# EAGLE design sensor_board (EAGLE 9.7.0)
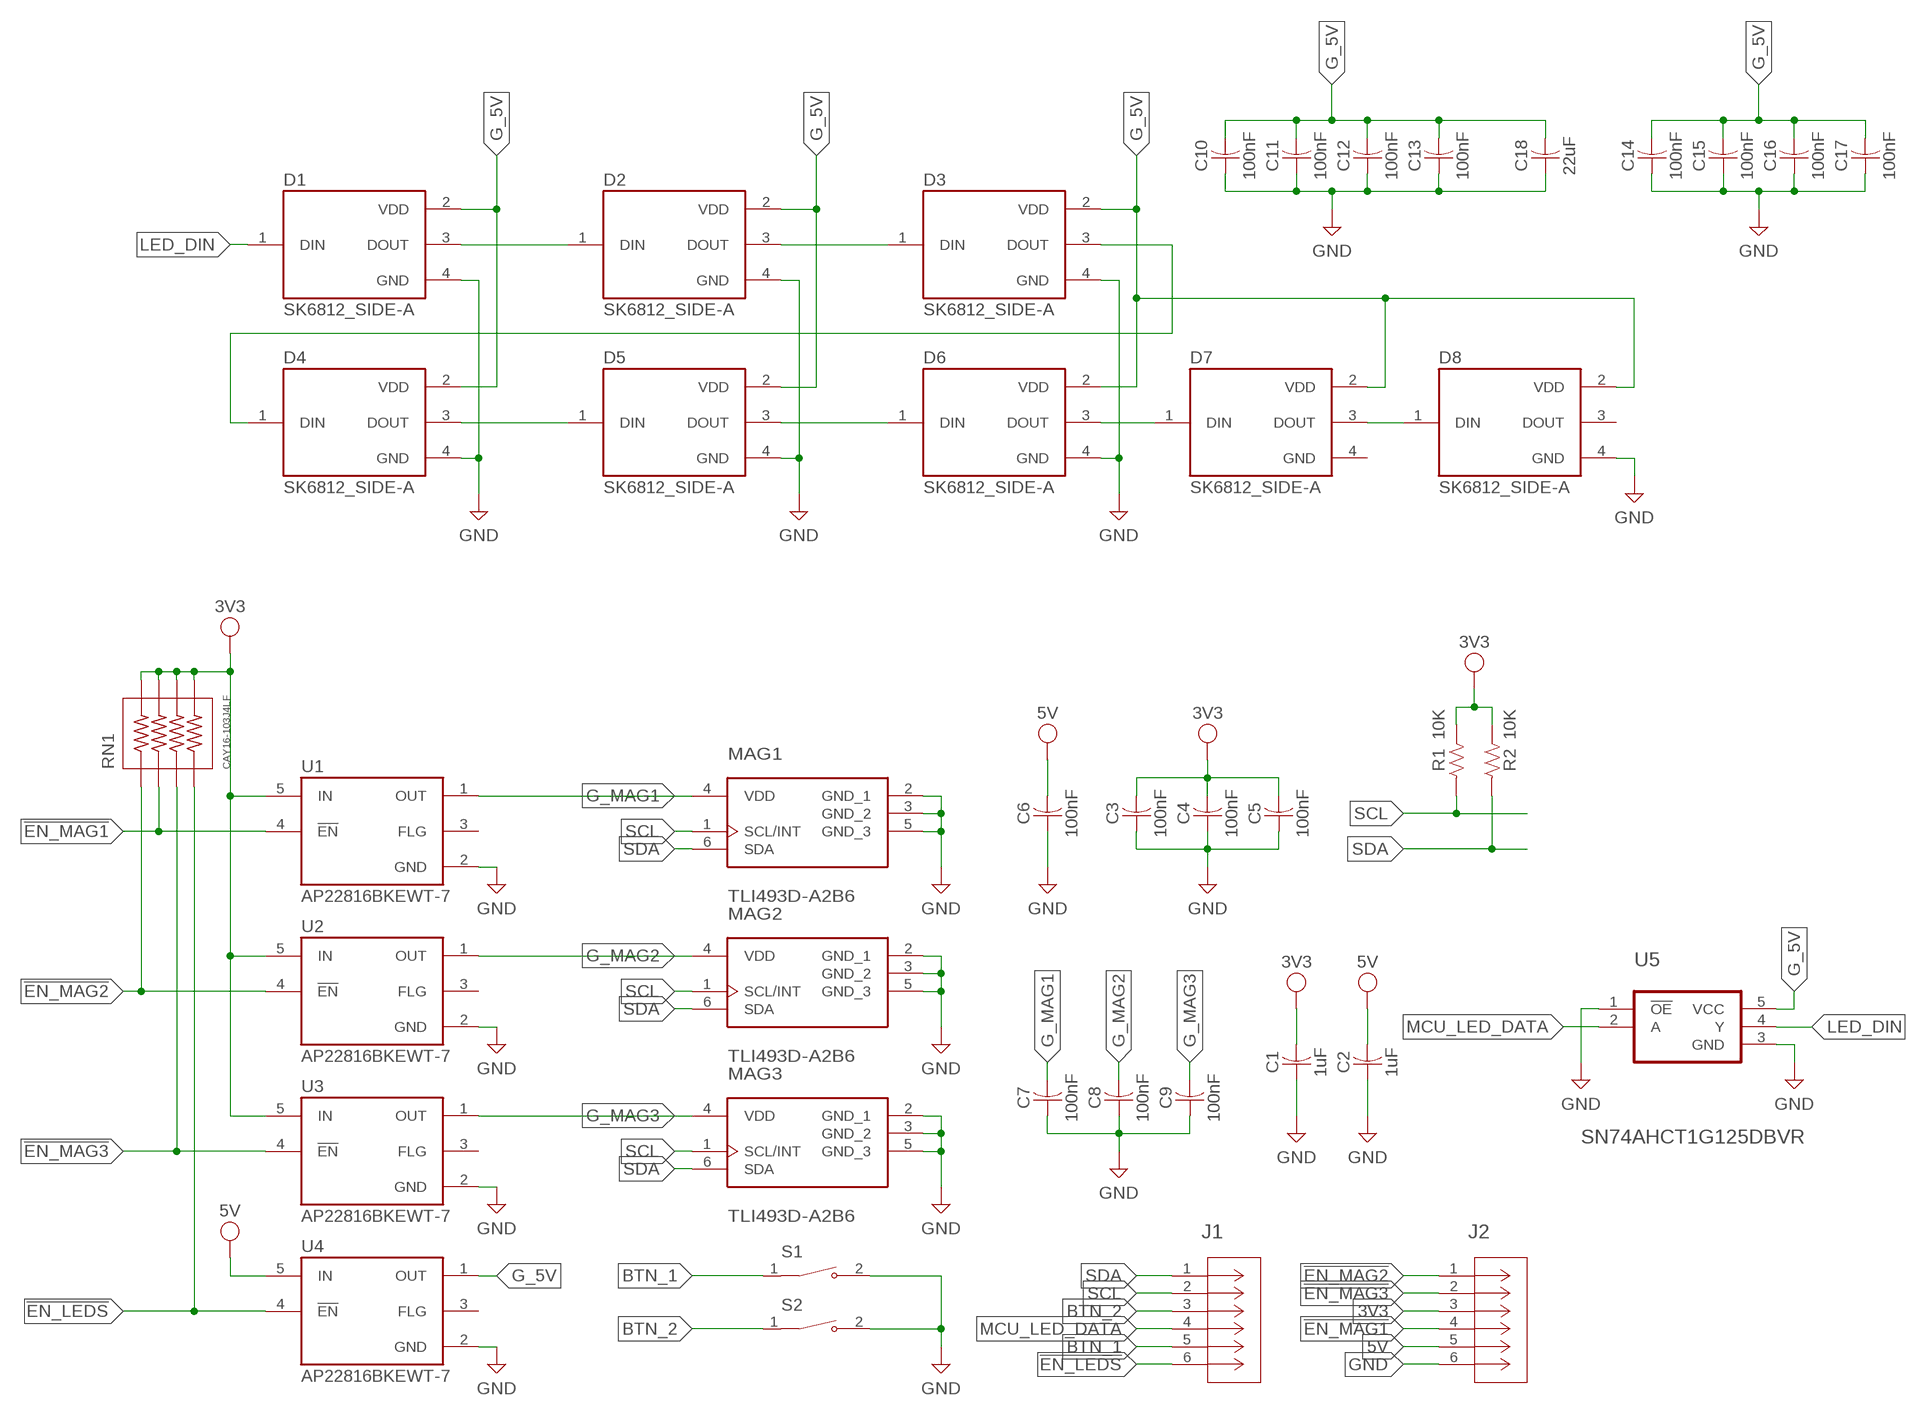
[diagram p0: schematic, sheet 1]

## Parts
C1  1uF  C-US_CHIP-1206(3216-METRIC)  [CAPC3216X135]
C2  1uF  C-US_CHIP-1206(3216-METRIC)  [CAPC3216X135]
C3  100nF  C-US_CHIP-0805(2012-METRIC)  [CAPC2012X110]
C4  100nF  C-US_CHIP-0805(2012-METRIC)  [CAPC2012X110]
C5  100nF  C-US_CHIP-0805(2012-METRIC)  [CAPC2012X110]
C6  100nF  C-US_CHIP-0805(2012-METRIC)  [CAPC2012X110]
C7  100nF  C-US_CHIP-0805(2012-METRIC)  [CAPC2012X110]
C8  100nF  C-US_CHIP-0805(2012-METRIC)  [CAPC2012X110]
C9  100nF  C-US_CHIP-0805(2012-METRIC)  [CAPC2012X110]
C10  100nF  C-US_CHIP-0805(2012-METRIC)  [CAPC2012X110]
C11  100nF  C-US_CHIP-0805(2012-METRIC)  [CAPC2012X110]
C12  100nF  C-US_CHIP-0805(2012-METRIC)  [CAPC2012X110]
C13  100nF  C-US_CHIP-0805(2012-METRIC)  [CAPC2012X110]
C14  100nF  C-US_CHIP-0805(2012-METRIC)  [CAPC2012X110]
C15  100nF  C-US_CHIP-0805(2012-METRIC)  [CAPC2012X110]
C16  100nF  C-US_CHIP-0805(2012-METRIC)  [CAPC2012X110]
C17  100nF  C-US_CHIP-0805(2012-METRIC)  [CAPC2012X110]
C18  22uF  C-US_CHIP-1206(3216-METRIC)  [CAPC3216X135]
D1  SK6812_SIDE-A  [LED_SK6812_SIDE-A]
D2  SK6812_SIDE-A  [LED_SK6812_SIDE-A]
D3  SK6812_SIDE-A  [LED_SK6812_SIDE-A]
D4  SK6812_SIDE-A  [LED_SK6812_SIDE-A]
D5  SK6812_SIDE-A  [LED_SK6812_SIDE-A]
D6  SK6812_SIDE-A  [LED_SK6812_SIDE-A]
D7  SK6812_SIDE-A  [LED_SK6812_SIDE-A]
D8  SK6812_SIDE-A  [LED_SK6812_SIDE-A]
J1  NPPN032AFCN-RCCONN3X2_NPPN032AFCN-RC_SUL  [CONN3X2_NPPN032AFCN-RC_SUL]
J2  NPPN032AFCN-RCCONN3X2_NPPN032AFCN-RC_SUL  [CONN3X2_NPPN032AFCN-RC_SUL]
MAG1  TLI493D-A2B6  [SOP95P280X110-6N-V]
MAG2  TLI493D-A2B6  [SOP95P280X110-6N-V]
MAG3  TLI493D-A2B6  [SOP95P280X110-6N-V]
R1  10K  R-US_CHIP-0805(2012-METRIC)  [RESC2012X65]
R2  10K  R-US_CHIP-0805(2012-METRIC)  [RESC2012X65]
RN1  CAY16-103J4LF  [RESCAF80P320X160X60-8N]
S1  TS32-7-35-BK-160-RA-SMT-TR  [SW_TS32-7-35-BK-160-RA-SMT-TR]
S2  TS32-7-35-BK-160-RA-SMT-TR  [SW_TS32-7-35-BK-160-RA-SMT-TR]
U1  AP22816BKEWT-7  [SOT95P280X100-5N]
U2  AP22816BKEWT-7  [SOT95P280X100-5N]
U3  AP22816BKEWT-7  [SOT95P280X100-5N]
U4  AP22816BKEWT-7  [SOT95P280X100-5N]
U5  SN74AHCT1G125DBVR  [SOT95P280X145-5N]

## Nets
3V3: C1.2 C3.2 C4.2 C5.2 J2.3 R1.2 R2.2 RN1.5 RN1.6 RN1.7 RN1.8 U1.5(IN) U2.5(IN) U3.5(IN)
5V: C2.2 C6.2 J2.5 U4.5(IN)
!EN_LEDS: J1.6 RN1.4 U4.4(!EN)
!EN_MAG1: J2.4 RN1.2 U1.4(!EN)
!EN_MAG2: J2.1 RN1.1 U2.4(!EN)
!EN_MAG3: J2.2 RN1.3 U3.4(!EN)
BTN_1: J1.5 S1.1
BTN_2: J1.3 S2.1
G_5V: C10.2 C11.2 C12.2 C13.2 C14.2 C15.2 C16.2 C17.2 C18.2 D1.2(VDD) D2.2(VDD) D3.2(VDD) D4.2(VDD) D5.2(VDD) D6.2(VDD) D7.2(VDD) D8.2(VDD) U4.1(OUT) U5.5(VCC)
G_MAG1: C7.2 MAG1.4(VDD) U1.1(OUT)
G_MAG2: C8.2 MAG2.4(VDD) U2.1(OUT)
G_MAG3: C9.2 MAG3.4(VDD) U3.1(OUT)
GND: C1.1 C2.1 C3.1 C4.1 C5.1 C6.1 C7.1 C8.1 C9.1 C10.1 C11.1 C12.1 C13.1 C14.1 C15.1 C16.1 C17.1 C18.1 D1.4(GND) D2.4(GND) D3.4(GND) D4.4(GND) D5.4(GND) D6.4(GND) D8.4(GND) J2.6 MAG1.2(GND_1) MAG1.3(GND_2) MAG1.5(GND_3) MAG2.2(GND_1) MAG2.3(GND_2) MAG2.5(GND_3) MAG3.2(GND_1) MAG3.3(GND_2) MAG3.5(GND_3) S1.2 S2.2 U1.2(GND) U2.2(GND) U3.2(GND) U4.2(GND) U5.1(!OE) U5.3(GND)
LED_DIN: D1.1(DIN) U5.4(Y)
MCU_LED_DATA: J1.4 U5.2(A)
N$1: D1.3(DOUT) D2.1(DIN)
N$2: D2.3(DOUT) D3.1(DIN)
N$3: D6.3(DOUT) D7.1(DIN)
N$4: D3.3(DOUT) D4.1(DIN)
N$5: D4.3(DOUT) D5.1(DIN)
N$6: D5.3(DOUT) D6.1(DIN)
N$7: D7.3(DOUT) D8.1(DIN)
SCL: J1.2 MAG1.1(SCL/INT) MAG2.1(SCL/INT) MAG3.1(SCL/INT) R1.1
SDA: J1.1 MAG1.6(SDA) MAG2.6(SDA) MAG3.6(SDA) R2.1
Unconnected: D8.3(DOUT) U1.3(FLG) U2.3(FLG) U3.3(FLG) U4.3(FLG)

## Power pins joined to a net without a drawn wire
GND: D7.4(GND)

## Library data of the parts
C1 C2 C18 = Capacitor:C-US: Capacitor - ANSI; CATEGORY: Capacitor; PACKAGE_SIZE: 1206; PACKAGE_TYPE: Surface Mount; SUBCATEGORY: Ceramic Capacitors; TYPE: MLCC
C3-C17 = Capacitor:C-US: Capacitor - ANSI; CATEGORY: Capacitor; PACKAGE_SIZE: 0805; PACKAGE_TYPE: Surface Mount; SUBCATEGORY: Ceramic Capacitors; TYPE: MLCC
D1-D8 = SK6812_SIDE-A:SK6812_SIDE-A: Check availability <https://pricing.snapeda.com/parts/SK6812%20SIDE-A/Norman%20Electric/view-part?ref=eda>; AVAILABILITY: Not in stock; CHECK_PRICES: https://www.snapeda.com/parts/SK6812%20SIDE-A/Norman+Electric/view-part/?ref=eda; DESCRIPTION: INTEGRATED LIGHT SOURCE INTELLIGENT CONTROL OF CHIP-ON-TOP SMD TYPE LED; MF: Norman Electric; MP: SK6812 SIDE-A; PACKAGE: NON-STANDARD-4 Normand Electronics; PRICE: None; SNAPEDA_LINK: https://www.snapeda.com/parts/SK6812%20SIDE-A/Norman+Electric/view-part/?ref=snap
J1 J2 = NPPN032AFCN-RC:NPPN032AFCN-RC; COPYRIGHT: Copyright (C) 2026 Ultra Librarian. All rights reserved.; MANUFACTURER_NAME: Sullins; MANUFACTURER_PART_NUMBER: NPPN032AFCN-RC
MAG1-MAG3 = TLI493D-A2B6:TLI493D-A2B6: TLI493D-A2B6 SOP95P280X110-6N-V Low Power 3D Hall Sensor with I2C Interface and Wake Up Function
R1 R2 = Resistor:R-US: Resistor Fixed - ANSI; CATEGORY: Resistors; DESCRIPTION: Chip Resistor 2.00 X 1.25 X 0.65 mm body 0805(2012-METRIC) Package; PACKAGE_SIZE: 0805; PACKAGE_TYPE: Surface Mount
RN1 = CAY16-103J4LF:CAY16-103J4LF: Res Thick Film Array 75 Ohm 5% 0.25W(1/4W) ?200ppm/C ISOL Molded 8-Pin 1206(4 X 0603) Convex SMD T/R; CHECK_PRICES: https://www.snapeda.com/parts/CAY16-103J4LF/Bourns+-+J.W.+Miller/view-part/?ref=eda; DESCRIPTION: Resistor, Chip Array,10 Kilohms,62 mW,+ 5%,50 V (Max.) | Bourns CAY16-103J4LF; DIGIKEY_PART_NUMBER: CAY16-103J4LFTR-ND; MF: Bourns; MP: CAY16-103J4LF; PACKAGE: 1206 Bourns; PURCHASE-URL: https://www.snapeda.com/api/url_track_click_mouser/?unipart_id=47136&manufacturer=Bourns&part_name=CAY16-103J4LF&search_term=None; SNAPEDA_LINK: https://www.snapeda.com/parts/CAY16-103J4LF/Bourns+-+J.W.+Miller/view-part/?ref=snap
S1 S2 = TS32-7-35-BK-160-RA-SMT-TR:TS32-7-35-BK-160-RA-SMT-TR; MANUFACTURER: Same Sky; MAXIMUM_PACKAGE_HEIGHT: 3.7mm; PARTREV: 1.0; STANDARD: Manufacturer Recommendations
U1-U4 = AP22816BKEWT-7:AP22816BKEWT-7: Check availability <https://pricing.snapeda.com/parts/AP22816BKEWT-7/Diodes%20Zetex/view-part?ref=eda>; AVAILABILITY: In Stock; CHECK_PRICES: https://www.snapeda.com/parts/AP22816BKEWT-7/Diodes+Inc./view-part/?ref=eda; DESCRIPTION: Power Switch/Driver 1:1 N/P-Channel 1A TSOT-25; MF: Diodes Zetex; MP: AP22816BKEWT-7; PACKAGE: None; PRICE: None; SNAPEDA_LINK: https://www.snapeda.com/parts/AP22816BKEWT-7/Diodes+Inc./view-part/?ref=snap
U5 = SN74AHCT1G125DBVR:SN74AHCT1G125DBVR

## Board
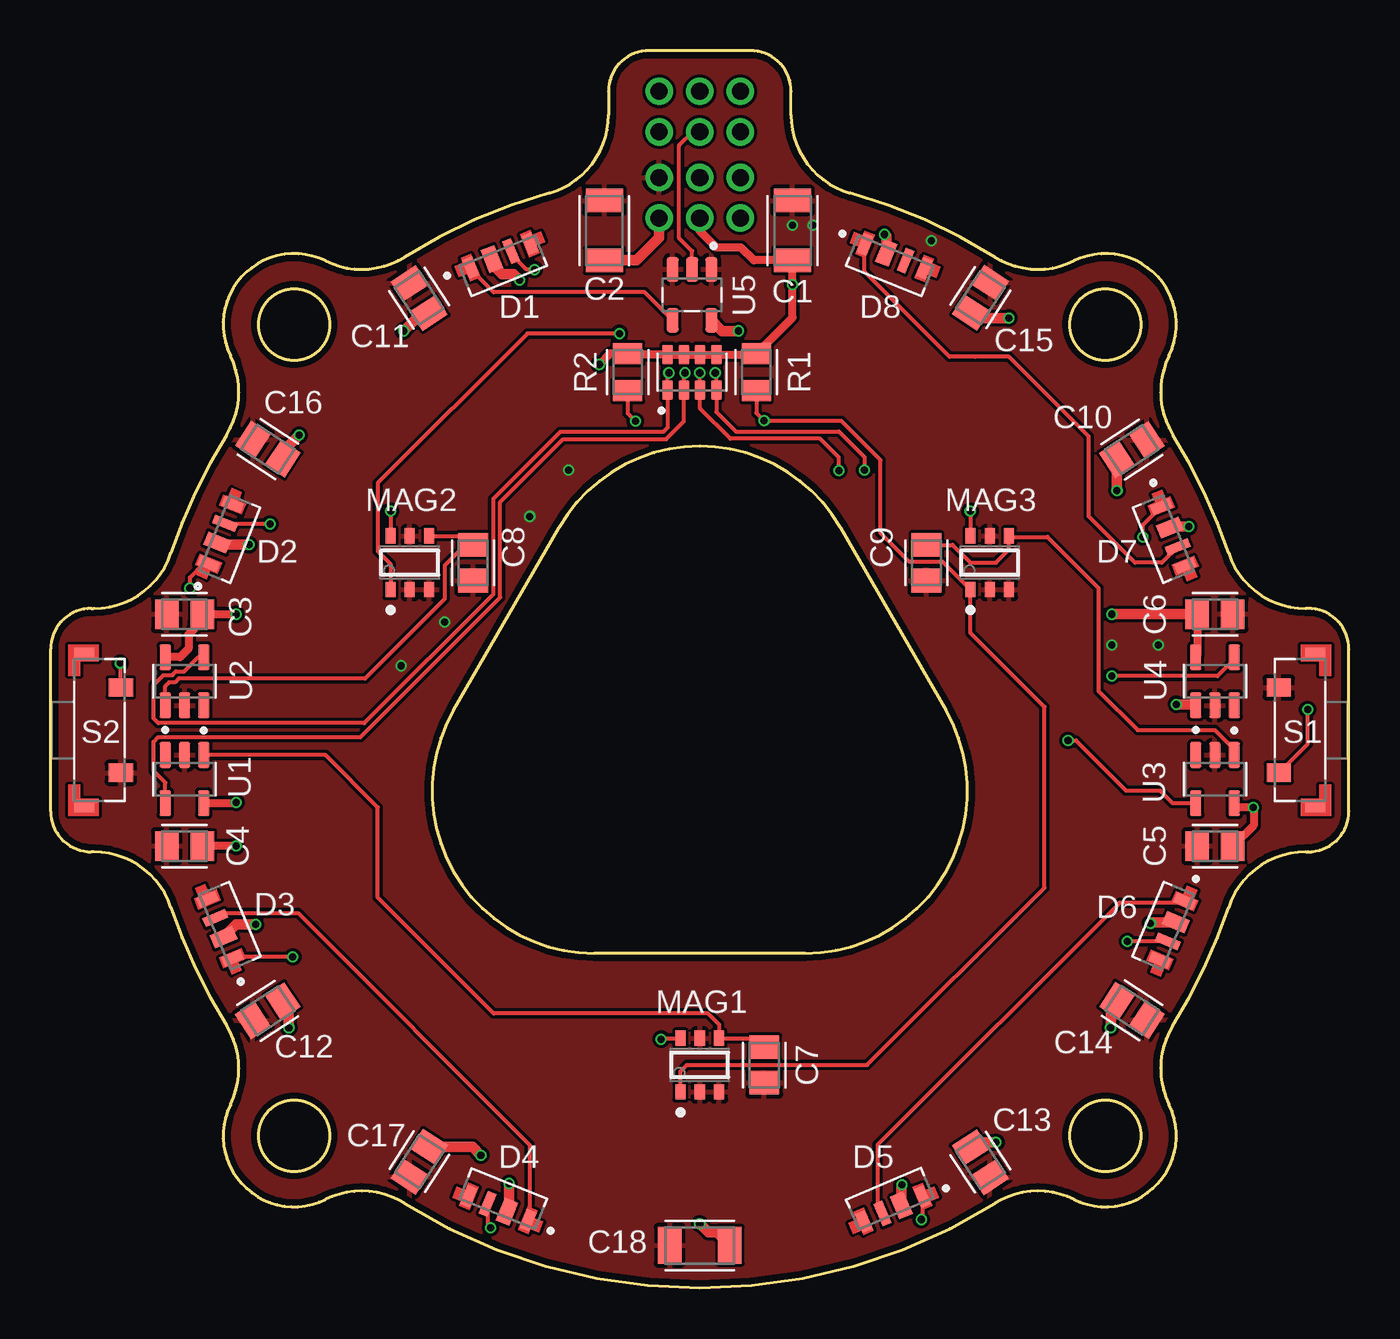
[diagram p1: board, top side]
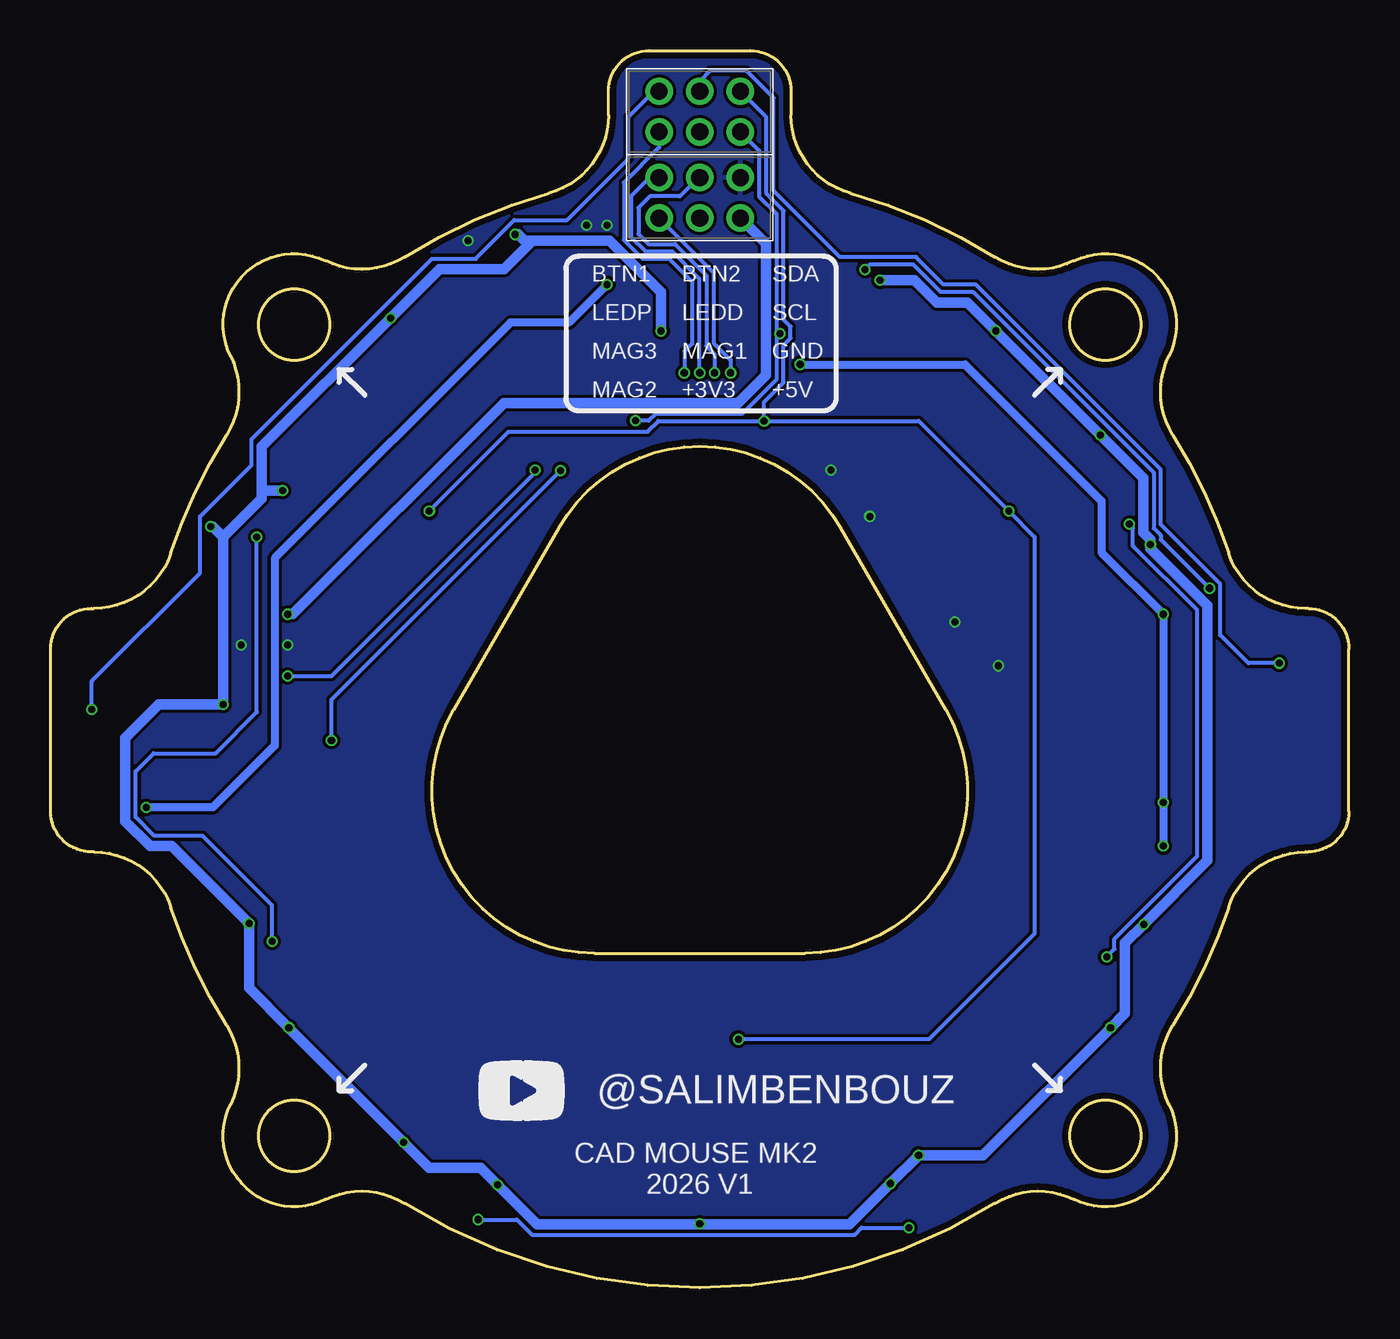
[diagram p2: board, bottom side, seen from below]

Size 64 x 61 mm. Coordinates in mm from the lower left corner, seen from the top.
Outline: 37.2,16.5 26.8,16.5 arc-120 19.88,28.5 25.07,37.5 arc-120 38.93,37.5 44.12,28.5 arc-120 37.2,16.5
Outline: 55.33,12.94 arc13 58.08,18.77 arc-71 61.87,21.5 62,21.5 arc90 64,23.5 64,31.5 arc90 62,33.5 61.87,33.5 arc-71 58.08,36.23 arc13 55.33,42.06 arc-58 55.14,45.95 arc143 50.45,50.64 arc-58 46.56,50.83 arc16 39.42,53.98 arc-74 36.5,57.83 36.5,59 arc90 34.5,61 29.5,61 arc90 27.5,59 27.5,57.83 arc-74 24.58,53.98 arc16 17.44,50.83 arc-58 13.55,50.64 arc143 8.86,45.95 arc-58 8.67,42.06 arc13 5.92,36.23 arc-71 2.13,33.5 2,33.5 arc90 0,31.5 0,23.5 arc90 2,21.5 2.13,21.5 arc-71 5.92,18.77 arc13 8.67,12.94 arc-58 8.86,9.05 arc143 13.55,4.36 arc-58 17.44,4.17 arc64 46.56,4.17 arc-58 50.45,4.36 arc143 55.14,9.05 arc-58 55.33,12.94
Outline: circle at 52,47.5 radius 1.75
Outline: circle at 12,47.5 radius 1.75
Outline: circle at 12,7.5 radius 1.75
Outline: circle at 52,7.5 radius 1.75
Copper layers (1*16): Top 0.035mm / dielectric 1.5mm / Bottom 0.035mm
Design rules "PCBWay_2L_152um-Track.dru": minimum track width 6mil, minimum drill 0.3mm, track to track 6mil, track to pad 6mil, pad to pad 6mil, via to via 6mil, smd to smd 0mil, copper to edge 0.3mm, drill to drill 10mil, minimum pad ring 6mil, minimum via ring 0.1mm, stop-mask expansion 2mil, vias tented up to drill 0.45mm, thermal gap 0.2mm

### Footprints (pad centres in the part's own frame; a part is rotated, then mirrored left to right if it is on the bottom)
CAPC3216X135 = smd 1.165 x 1.815: 1 -1.475,0; 2 1.475,0
CAPC2012X110 = smd 1.165 x 1.465: 1 -0.875,0; 2 0.875,0
LED_SK6812_SIDE-A = smd 0.5 x 1: 1 -1.525,0.525; 4 1.625,0.525 | smd 0.7 x 1.2: 2 -0.4,0.525 | smd 0.45 x 1.2: 3 0.625,0.525
CONN3X2_NPPN032AFCN-RC_SUL = drill 0.838 pad 1.346: 1 2,1; 2 2,-1; 3 0,1; 4 0,-1; 5 -2,1; 6 -2,-1
SOP95P280X110-6N-V = smd 0.75 x 0.5: 1 -1.325,0.95; 2 -1.325,0; 3 -1.325,-0.95; 4 1.325,-0.95; 5 1.325,0; 6 1.325,0.95
RESC2012X65 = smd 1.031 x 1.42: 1 -0.919,0; 2 0.919,0
RESCAF80P320X160X60-8N = smd 0.97 x 0.53: 1 -0.875,1.2; 2 -0.875,0.4; 3 -0.875,-0.4; 4 -0.875,-1.2; 5 0.875,-1.2; 6 0.875,-0.4; 7 0.875,0.4; 8 0.875,1.2
SW_TS32-7-35-BK-160-RA-SMT-TR = smd 0.9 x 1.2: 1 -2.1,1.3; 2 2.1,1.3 | smd 0.5 x 1: SH1 -3.8,-0.5; SH2 3.8,-0.5
SOT95P280X100-5N = smd 1.26 x 0.55: 1 -1.185,0.95; 2 -1.185,0; 3 -1.185,-0.95; 4 1.185,-0.95; 5 1.185,0.95
SOT95P280X145-5N = smd 1.21 x 0.59: 1 -1.255,0.95; 2 -1.255,0; 3 -1.255,-0.95; 4 1.255,-0.95; 5 1.255,0.95

### Placement (x,y rotation side)
C1  36.57,52.14 270 top
C2  27.3,52.14 270 top
C3  6.6,33.21 0 top
C4  6.6,21.78 0 top
C5  57.4,21.78 0 top
C6  57.4,33.21 180 top
C7  35.17,10.99 90 top
C8  20.82,35.75 90 top
C9  43.18,35.75 90 top
C10  53.3,41.33 213 top
C11  18.17,48.8 303 top
C12  10.7,13.67 33 top
C13  45.83,6.2 123 top
C14  53.31,13.69 147 top
C15  45.84,48.82 237 top
C16  10.71,41.36 327 top
C17  18.18,6.22 57 top
C18  32,2.1 0 top
D1  22.32,50.39 22 top
D2  8.85,36.92 68 top
D3  8.85,17.87 113 top
D4  22.32,4.4 158 top
D5  41.37,4.4 203 top
D6  54.84,17.87 247 top
D7  54.84,36.92 292 top
D8  41.37,50.39 338 top
J1  32,58 0 bottom
J2  32,53.75 180 bottom
MAG1  32,10.99 90 top
MAG2  17.7,35.75 90 top
MAG3  46.3,35.75 90 top
R1  34.79,45.15 90 top
R2  28.44,45.15 90 top
RN1  31.62,45.15 90 top
S1  61.84,27.5 90 top
S2  2.16,27.5 270 top
U1  6.6,25.09 270 top
U2  6.6,29.91 90 top
U3  57.4,25.09 270 top
U4  57.4,29.91 90 top
U5  31.62,48.96 270 top

### Tracks (layer width: path | path; a pad name or v marks a point on that pad's centre or on a via)
3V3  (via drill 0.35)
  Top 0.406: J2.3 32,52.11 32.82,51.3 34.03,51.3 34.67,50.66 C1.2 v36.57,49.47 36.57,47.85 R1.2 34.75,46.03 RN1.5 RN1.6 RN1.7 RN1.8 28.49,46.03 R2.2 27.59,46.07 v27.05,45.53 | 59.3,23.69 59.3,22.81 C5.2 | 59.3,23.69 58.56,23.69 U3.5 | v9.14,21.78 C4.2 | U1.5 9.1,23.9 v9.14,23.94 | v9.14,33.21 C3.2 7.09,32.83 7.09,32.52 6.79,32.22 6.79,31.51 6.38,31.1 U2.5 | v59.28,23.69 59.3,23.69
  Bottom 0.406: v36.57,49.47 38.45,47.6 41.34,47.6 52.95,35.98 52.95,26.74 56,23.69 v59.28,23.69 | v27.05,45.53 18.92,45.53 12.19,38.8 12.19,36.26 v9.14,33.21 v9.14,23.94 v9.14,21.78
5V  (via drill 0.35)
  Top 0.406: C6.2 56.52,31.17 U4.5
  Top 0.508: J2.5 30,51.79 28.87,50.66 C2.2 | C6.2 v52.32,33.21
  Bottom 0.508: v52.32,33.21 52.07,33.21 41.65,43.63 30.11,43.63 28.73,45.01 28.73,51.48 J2.5
!EN_LEDS  (via drill 0.35)
  Top 0.203: U4.4 58.35,30.99 57.53,30.17 v52.32,30.17 | v40.13,40.33 40.13,40.96 38.86,42.23 33.78,42.23 32.82,43.19 RN1.4 32.82,45.06 v32.76,45.12
  Bottom 0.203: v52.32,30.17 50.16,30.17 40.13,40.2 v40.13,40.33 | J1.6 34,56.23 35.74,54.49 35.74,51.67 34.83,50.76 33.51,50.76 32.38,49.62 32.38,46.55 32.76,46.17 v32.76,45.12
!EN_MAG1  (via drill 0.35)
  Top 0.203: U1.4 5.65,24.92 5.08,25.49 5.08,26.92 5.31,27.16 15.28,27.16 22.17,34.04 22.17,38.75 25.27,41.85 30.34,41.85 31.22,42.73 RN1.2 31.22,45.06 v31.28,45.12
  Bottom 0.203: J2.4 32.05,54.75 32.98,53.82 34.46,53.82 35.03,53.25 35.03,51.96 34.53,51.47 33.22,51.47 31.67,49.92 31.67,46.44 31.28,46.05 v31.28,45.12
!EN_MAG2  (via drill 0.35)
  Top 0.203: U2.4 7.28,31.1 6.57,30.4 6.17,30.4 5.99,30.21 5.56,30.21 5.08,29.73 5.08,28.08 5.31,27.84 15.46,27.84 21.81,34.19 21.81,38.9 25.12,42.21 30.2,42.21 30.42,42.43 RN1.1 30.42,45.06 v30.48,45.12
  Bottom 0.203: J2.1 31.31,50.06 31.31,46.59 30.48,45.75 v30.48,45.12
!EN_MAG3  (via drill 0.35)
  Top 0.203: v38.86,40.31 38.86,40.94 37.93,41.86 33.51,41.86 32.02,43.36 RN1.3 32.02,45.1 v32,45.12 | U3.4 55.31,23.9 54.69,24.52 53.02,24.52 50.55,26.99 v50.16,26.99
  Bottom 0.203: v50.16,26.99 50.16,29 v38.86,40.31 | J2.2 34.47,54.75 35.38,53.83 35.38,51.82 34.68,51.11 33.37,51.11 32.02,49.77 32.02,45.27 32,45.24 v32,45.12
BTN_1  (via drill 0.35)
  Top 0.203: S1.1 61.97,26.83 v61.97,28.52
  Bottom 0.203: v61.97,28.52 61.97,29.91 56.64,35.25 56.64,38.04 54.1,40.58 54.1,41.85 45.21,50.74 43.05,50.74 41.14,52.65 38.55,52.65 35.51,55.68 35.51,57.74 34.25,59 J1.5
BTN_2  (via drill 0.35)
  Top 0.203: S2.1 3.45,30.77 v3.43,30.8
  Bottom 0.203: v3.43,30.8 4.95,30.8 6.34,32.19 6.34,34.71 9.27,37.65 9.27,40.35 18.39,49.47 19.98,49.47 21.33,50.82 25.08,50.82 28.36,54.11 28.36,58.67 29.7,60.01 31.49,60.01 32,59.5 J1.3
G_5V  (via drill 0.35)
  Top 0.508: U4.1 56.41,28.77 v55.5,28.77 | v33.91,47.18 33.09,47.18 U5.5 | C10.2 v52.57,39.32 v52.57,39.31 | D7.2 55.22,37.53 v56.11,37.53 | C15.2 45.64,47.82 v47.24,47.82 | D6.2 54.28,18.03 v54.23,17.97 | C14.2 52.26,13.84 v52.26,12.83 | C13.2 45.61,7.18 v46.61,7.18 | D5.2 41.94,5.06 v41.97,5.08 | D4.2 22.6,3.87 v22.6,5.15 | C17.2 20.8,6.95 v21.2,6.54 | C12.2 11.74,13.83 v11.74,12.83 | D2.2 8.31,36.64 v9.77,36.64 | C16.2 11.44,41.23 v12.25,42.04 | C11.2 18.28,48.07 v17.39,47.18 | D1.2 21.75,50.47 22.24,49.98 22.81,49.98 v23.11,49.68 | C18.2 32.84,2.73 32.42,2.73 v32,3.16 | D3.2 9.14,17.92 v10.1,17.92 | D8.2 41.19,51.85 v41.1,51.94
  Bottom 0.508: 55.5,37.02 v55.5,28.77 58.67,28.77 60.32,27.12 60.32,23.01 59.1,21.78 58.03,21.78 v54.23,17.97 54.23,14.8 v52.26,12.83 v46.61,7.18 45.34,5.91 42.8,5.91 v41.97,5.08 40.02,3.14 32,3.14 | 53.59,39.31 53.59,38.93 55.5,37.02 | 53.59,39.31 53.59,41.47 v47.24,47.82 44.83,50.23 41.65,50.23 40.26,51.63 | 40.26,51.63 36.45,51.63 33.91,49.09 v33.91,47.18 | 40.26,51.63 40.64,51.63 40.95,51.94 v41.1,51.94 | v52.57,39.31 53.59,39.31 | 55.5,37.02 56,37.53 v56.11,37.53 | v32,3.16 32,3.14 | 32,3.14 24.61,3.14 v22.6,5.15 v21.2,6.54 18.03,6.54 v11.74,12.83 11.05,13.53 11.05,17 10.11,17.93 | 10.11,17.93 v10.1,17.92 | v23.11,49.68 21.42,49.68 20.32,48.58 18.79,48.58 v17.39,47.18 v12.25,42.04 10.13,39.92 10.13,37.25 9.77,36.9 v9.77,36.64 9.77,36.44 6.97,33.63 6.97,21.08 10.11,17.93
G_MAG1
  Top 0.203: U1.1 13.54,26.27 16.12,23.69 16.12,19.24 21.84,13.53 32.4,13.53 32.95,12.98 MAG1.4 34.73,12.31 C7.2
G_MAG2
  Top 0.203: MAG2.4 20.37,37.08 C8.2 20.43,36.63 19.43,35.63 19.43,33.98 15.49,30.04 6.32,30.04 6.14,29.86 5.84,29.86 5.65,29.67 U2.1
G_MAG3
  Top 0.203: C9.2 44.46,36.63 45.34,35.75 46.61,35.75 47.25,36.4 MAG3.4 47.3,37.02 49.14,37.02 51.66,34.51 51.66,29.43 53.59,27.5 57.4,27.5 58.35,26.55 U3.1
GND  (via drill 0.35)
  other vias: 43.43,51.63 36.57,52.39 37.59,52.39 25.52,40.33 23.62,38.04 54.61,31.69 52.32,31.69 19.43,32.83 17.27,30.67
  pour Bottom: -3.48,-3.54 68.12,-3.54 68.12,63.62 -3.48,63.62
  pour Top: -2.85,-2.9 67.48,-2.9 67.48,62.98 -2.85,62.98
LED_DIN
  Top 0.203: U5.4 29.29,49.09 21.84,49.09 20.71,50.22 D1.1
MCU_LED_DATA
  Top 0.203: U5.2 31.62,51.12 30.98,51.76 30.98,56.33 31.66,57 J1.4
N$1  (via drill 0.35)
  Top 0.203: v6.86,34.49 6.86,35.03 7.53,35.7 D2.1 | D1.3 22.7,50.98 23.47,50.21 v23.85,50.21
  Bottom 0.203: v23.85,50.21 23.6,50.47 21.48,50.47 20.13,49.11 18.54,49.11 9.62,40.2 9.62,37.46 9.27,37.11 9.27,36.9 v6.86,34.49
N$2  (via drill 0.35)
  Top 0.203: D2.3 10.75,37.7 10.79,37.66 v10.81,37.66 | v11.93,16.32 9.02,16.32 D3.1
  Bottom 0.203: v11.93,16.32 11.55,16.7 11.55,17.21 7.48,21.29 7.48,33.42 10.64,36.59 10.64,37.49 v10.81,37.66
N$3  (via drill 0.35)
  Top 0.203: D6.3 v53.08,17.09 | v53.84,37.02 53.84,37.62 54.63,38.4 D7.1
  Bottom 0.203: v53.08,17.09 53.08,18.86 56.51,22.29 58.89,22.29 59.81,23.22 59.81,25.47 58.92,26.36 55.88,26.36 53.84,28.39 v53.84,37.02
N$4
  Top 0.203: D3.3 8.36,18.48 12.19,18.48 23.62,7.05 23.62,5.91 23.62,3.42 D4.1
N$5  (via drill 0.35)
  Top 0.203: D4.3 21.52,4.13 21.54,4.11 21.54,3.11 v21.69,2.96 | D4.3 | D5.1 42.98,3.42 v42.92,3.37
  Bottom 0.203: v21.69,2.96 24.02,2.96 24.36,2.63 40.28,2.63 41.02,3.37 v42.92,3.37
N$6
  Top 0.203: D5.3 40.76,3.9 40.76,5.27 40.76,7.05 52.7,18.99 55.84,18.99 D6.1
N$7
  Top 0.203: D7.3 54.78,35.75 53.46,35.75 51.18,38.04 51.18,41.98 47.24,45.91 45.59,45.91 44.32,45.91 40.13,50.11 40.13,51.43 D8.1
SCL  (via drill 0.35)
  Top 0.203: R1.1 34.79,43.14 v35.17,42.76 35.17,42.74 38.98,42.74 40.92,40.81 40.92,37.21 42.34,35.79 43.98,35.79 MAG3.1 45.35,32.29 49,28.64 49,19.73 40.26,10.99 31.36,10.99 31.05,10.67 MAG1.1 | MAG2.1 16.75,35.7 16.12,36.33 16.12,39.68 23.51,47.06 v28.05,47.06
  Bottom 0.203: J1.2 29.07,56.07 29.07,53.81 28.22,52.96 28.22,47.06 | 28.22,47.06 28.22,44.78 29.91,43.1 34.18,43.1 34.52,42.76 v35.17,42.76 | 28.22,47.06 v28.05,47.06
SDA  (via drill 0.35)
  Top 0.203: R2.1 28.44,43.12 v28.82,42.74 | v16.76,38.29 MAG2.6 | v45.34,38.29 v45.35,38.28 MAG3.6 | v30.09,12.26 30.15,12.31 MAG1.6
  Bottom 0.203: v28.82,42.74 21.2,42.74 v16.76,38.29 15.49,37.02 15.49,17.47 20.7,12.26 v30.09,12.26 | v28.82,42.74 34.04,42.74 34.57,42.21 41.42,42.21 v45.34,38.29 | J1.1 28.72,57.72 28.72,53.96 27.87,53.11 27.87,47.75 27.52,47.4 27.52,46.84 27.87,46.49 27.87,44.64 28.82,43.68 v28.82,42.74

### Text on the board
bPlace: SDA | BTN2 | BTN1 | SCL | LEDD | LEDP | GND | MAG1 | MAG3 | +5V | +3V3 | MAG2 | @SALIMBENBOUZ | CAD MOUSE MK2 / 2026 V1